# EAGLE schematic stm32_main_0_1 (EAGLE 5.10)
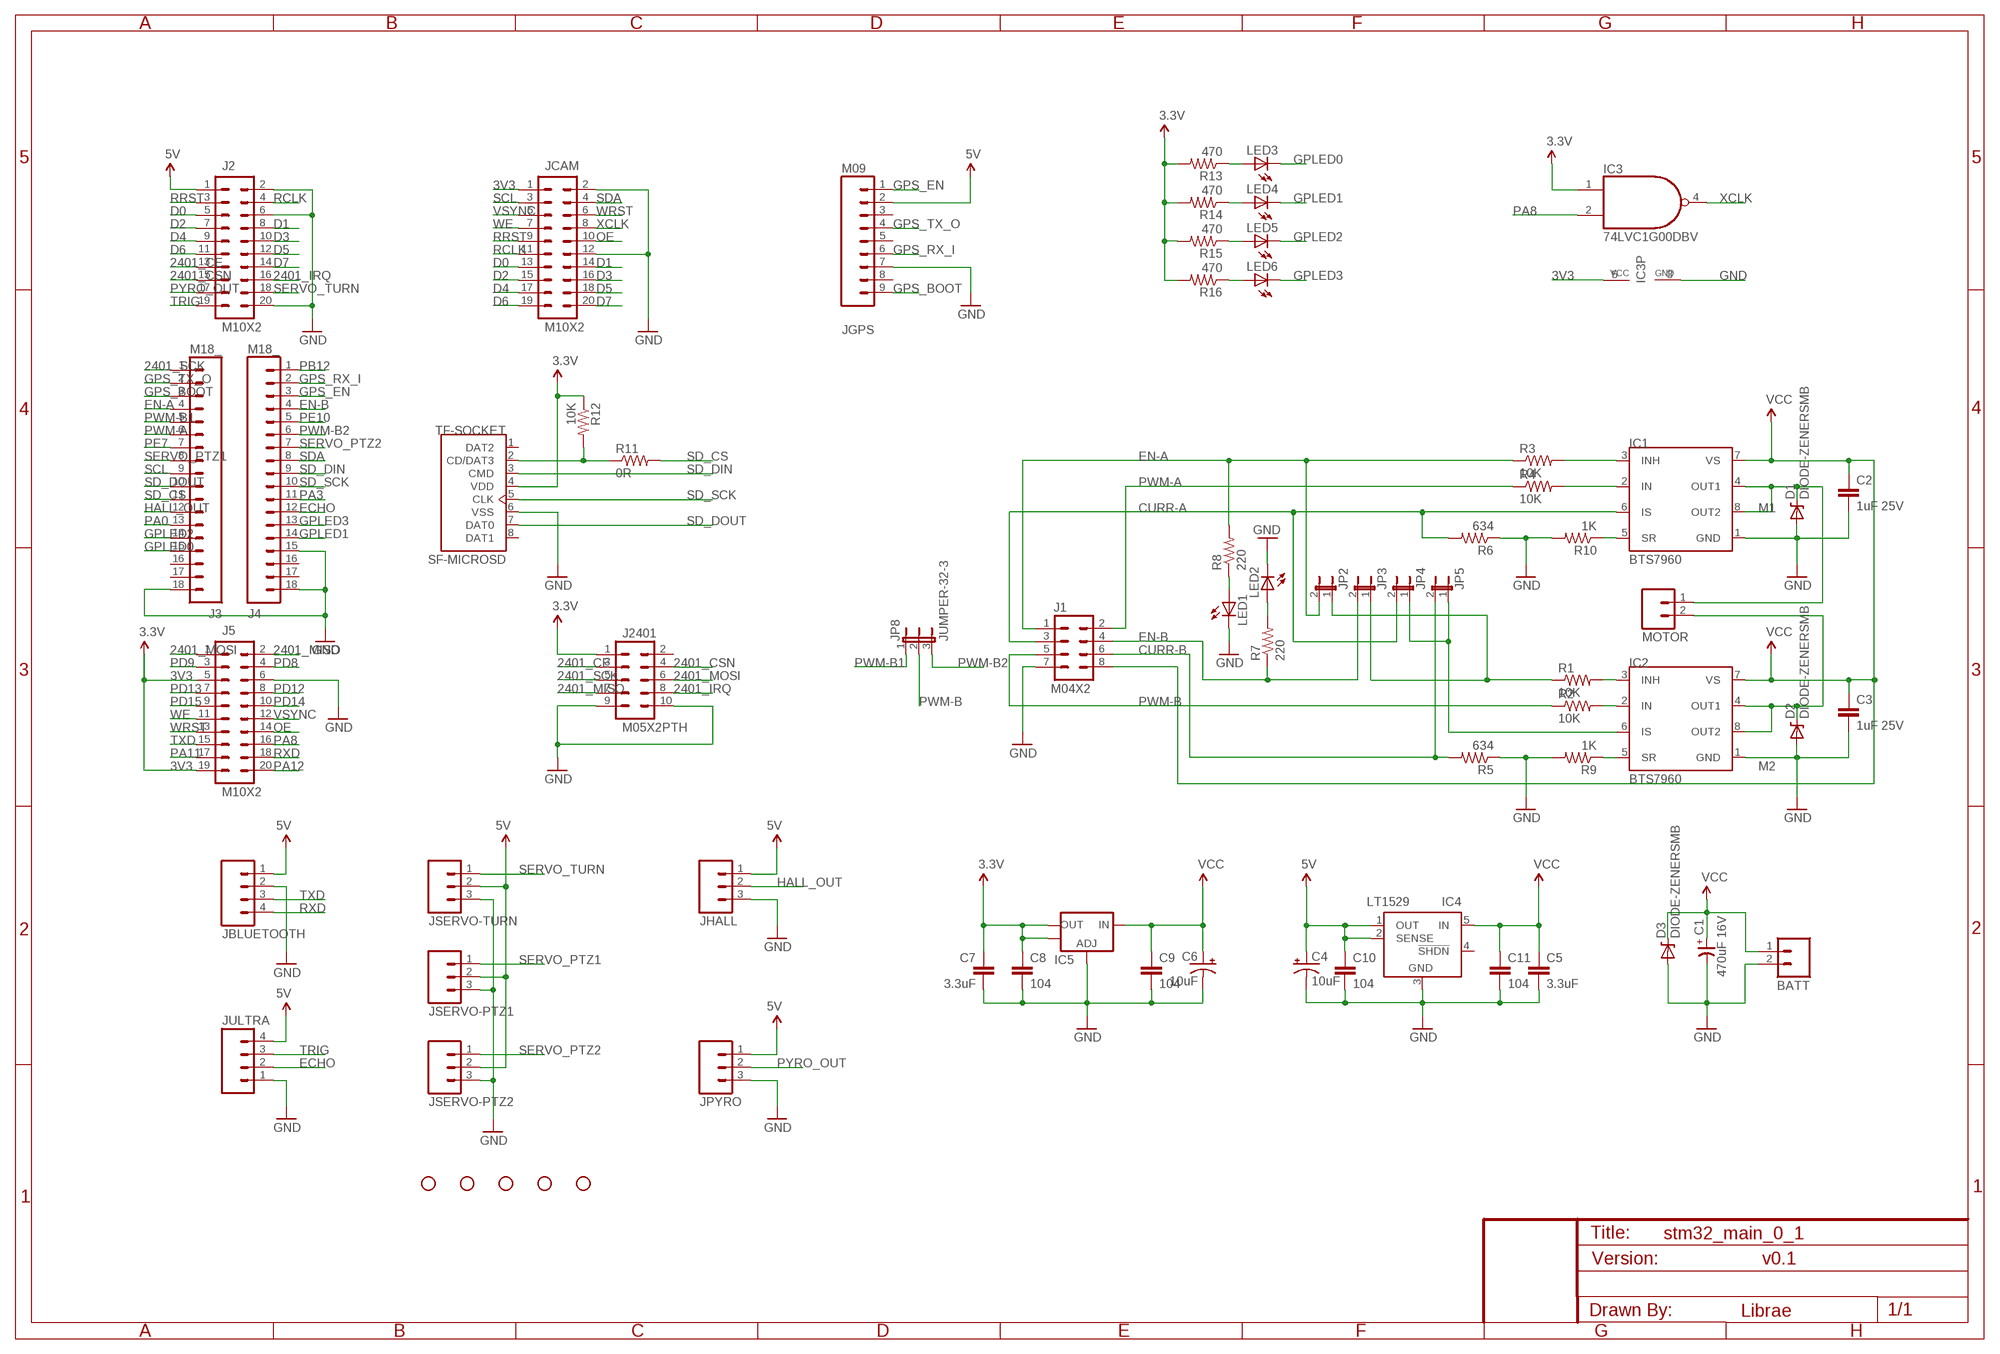
[diagram p0: schematic, sheet 1]

## Parts
BATT  M023.5MM  [SCREWTERMINAL-3.5MM-2]
C1  470uF 16V  CP-E-035X080  [E-035X080]
C2  1uF 25V  CAP0603-CAP  [0603-CAP]
C3  1uF 25V  CAP0603-CAP  [0603-CAP]
C4  10uF  CAP_POL3528  [EIA3528]
C5  3.3uF  CAP0603-CAP  [0603-CAP]
C6  10uF  CAP_POL3528  [EIA3528]
C7  3.3uF  CAP0603-CAP  [0603-CAP]
C8  104  CAP0603-CAP  [0603-CAP]
C9  104  CAP0603-CAP  [0603-CAP]
C10  104  CAP0603-CAP  [0603-CAP]
C11  104  CAP0603-CAP  [0603-CAP]
D1  DIODE-ZENERSMB  [SMB-DIODE]
D2  DIODE-ZENERSMB  [SMB-DIODE]
D3  DIODE-ZENERSMB  [SMB-DIODE]
IC1  BTS7960  [P-TO263-7-1]
IC2  BTS7960  [P-TO263-7-1]
IC3  74LVC1G00DBV  [SOT23-5]
IC4  LT1529  LT1129CT-5  [TO220-5]
IC5  V_REG_LM1117SOT223  [SOT223]
J1  M04X2  [2X4]
J2  M10X2  [2X10]
J3  M18_  [1X18]
J4  M18_  [1X18]
J5  M10X2  [2X10]
J2401  M05X2PTH  [AVR_ICSP]
JBLUETOOTH  M04PTH  [1X04]
JCAM  M10X2  [2X10]
JGPS  M09  [1X09]
JHALL  M03PTH  [1X03]
JP1  STAND-OFF  [STAND-OFF]
JP2  JUMPER-2SMD-NC  [SJ_2S]
JP3  JUMPER-2SMD-NC  [SJ_2S]
JP4  JUMPER-2SMD-NC  [SJ_2S]
JP5  JUMPER-2SMD-NC  [SJ_2S]
JP6  STAND-OFF  [STAND-OFF]
JP7  STAND-OFF  [STAND-OFF]
JP8  JUMPER-32-3  [SJ_3_PASTE2&3]
JP9  STAND-OFF  [STAND-OFF]
JP10  STAND-OFF  [STAND-OFF]
JPYRO  M03PTH  [1X03]
JSERVO-PTZ1  M03PTH  [1X03]
JSERVO-PTZ2  M03PTH  [1X03]
JSERVO-TURN  M03PTH  [1X03]
JULTRA  M04PTH  [1X04]
LED1  LED0603  [LED-0603]
LED2  LED0603  [LED-0603]
LED3  LED0603  [LED-0603]
LED4  LED0603  [LED-0603]
LED5  LED0603  [LED-0603]
LED6  LED0603  [LED-0603]
MOTOR  M023.5MM  [SCREWTERMINAL-3.5MM-2]
R1  10K  RESISTOR0603-RES  [0603-RES]
R2  10K  RESISTOR0603-RES  [0603-RES]
R3  10K  RESISTOR0603-RES  [0603-RES]
R4  10K  RESISTOR0603-RES  [0603-RES]
R5  634  RESISTOR0603-RES  [0603-RES]
R6  634  RESISTOR0603-RES  [0603-RES]
R7  220  RESISTOR0603-RES  [0603-RES]
R8  220  RESISTOR0603-RES  [0603-RES]
R9  1K  RESISTOR0603-RES  [0603-RES]
R10  1K  RESISTOR0603-RES  [0603-RES]
R11  0R  RESISTOR0603-RES  [0603-RES]
R12  10K  RESISTOR0603-RES  [0603-RES]
R13  470  RESISTOR0603-RES  [0603-RES]
R14  470  RESISTOR0603-RES  [0603-RES]
R15  470  RESISTOR0603-RES  [0603-RES]
R16  470  RESISTOR0603-RES  [0603-RES]
TF-SOCKET  SF-MICROSD  [MICROSD]

## Nets
3V3: C7.1 C8.1 IC3.1(I0) IC3.5(VCC) IC5.2(OUT) IC5.4(OUT) J5.5 J5.19 J2401.1 JCAM.1 R12.1 R13.2 R14.2 R15.2 R16.2 TF-SOCKET.4(VDD) ; supply symbol labelled 3.3V
5V: C4.A(+) C10.1 IC4.1(OUT) IC4.2(SENSE) J2.1 JBLUETOOTH.1 JGPS.2 JHALL.1 JPYRO.1 JSERVO-PTZ1.2 JSERVO-PTZ2.2 JSERVO-TURN.2 JULTRA.4
2401_CE: J2.13 J2401.3
2401_CSN: J2.15 J2401.4
2401_IRQ: J2.16 J2401.8
2401_MISO: J5.2 J2401.7
2401_MOSI: J5.1 J2401.6
2401_SCK: J3.1 J2401.5
CURR-A: IC1.6(IS) J1.3 JP4.2 R6.2
CURR-B: J1.6 JP5.2 R5.2
D0: J2.5 JCAM.13
D1: J2.8 JCAM.14
D2: J2.7 JCAM.15
D3: J2.10 JCAM.16
D4: J2.9 JCAM.17
D5: J2.12 JCAM.18
D6: J2.11 JCAM.19
D7: J2.14 JCAM.20
ECHO: J4.12 JULTRA.2
EN-A: J1.1 J3.4 JP2.2 R3.1 R8.2
EN-B: J1.4 J4.4 JP3.2 R7.1
GND: BATT.2 C1.- C2.2 C3.2 C4.C(-) C5.2 C6.C(-) C7.2 C8.2 C9.2 C10.2 C11.2 D1.A D2.A D3.A IC1.1(GND) IC2.1(GND) IC3.3(GND) IC4.3(GND) IC5.1(ADJ) J1.7 J2.2 J2.6 J2.20 J3.18 J4.15 J4.18 J5.6 J2401.9 J2401.10 JBLUETOOTH.2 JCAM.2 JCAM.12 JGPS.7 JHALL.3 JPYRO.3 JSERVO-PTZ1.3 JSERVO-PTZ2.3 JSERVO-TURN.3 JULTRA.1 LED1.C LED2.C R5.1 R6.1 R9.2 R10.2 TF-SOCKET.6(VSS)
GPLED0: J3.15 LED3.C
GPLED1: J4.14 LED4.C
GPLED2: J3.14 LED5.C
GPLED3: J4.13 LED6.C
GPS_BOOT: J3.3 JGPS.9
GPS_EN: J4.3 JGPS.1
GPS_RX_I: J4.2 JGPS.6
GPS_TX_O: J3.2 JGPS.4
HALL_OUT: J3.12 JHALL.2
M1: D1.C IC1.4(OUT1) IC1.8(OUT2) MOTOR.1
M2: D2.C IC2.4(OUT1) IC2.8(OUT2) MOTOR.2
N$1: IC2.3(INH) R1.2
N$2: JP2.1 JP3.1 R1.1
N$3: IC2.2(IN) R2.2
N$4: LED1.A R8.1
N$5: IC2.6(IS) JP4.1 JP5.1
N$6: LED2.A R7.2
N$7: IC1.3(INH) R3.2
N$8: IC1.2(IN) R4.2
N$9: IC1.5(SR) R10.1
N$10: IC2.5(SR) R9.1
N$11: R11.1 R12.2 TF-SOCKET.2(CD/DAT3)
N$15: LED5.A R15.1
N$16: LED4.A R14.1
N$17: LED3.A R13.1
N$18: LED6.A R16.1
OE: J5.14 JCAM.10
PA0: J3.13
PA3: J4.11
PA8: IC3.2(I1) J5.16
PA11: J5.17
PA12: J5.20
PB12: J4.1
PD8: J5.4
PD9: J5.3
PD12: J5.8
PD13: J5.7
PD14: J5.10
PD15: J5.9
PE7: J3.7
PE10: J4.5
PWM-A: J1.2 J3.6 R4.1
PWM-B: J1.5 JP8.2 R2.1
PWM-B1: J3.5 JP8.1
PWM-B2: J4.6 JP8.3
PYRO_OUT: J2.17 JPYRO.2
RCLK: J2.4 JCAM.11
RRST: J2.3 JCAM.9
RXD: J5.18 JBLUETOOTH.4
SCL: J3.9 JCAM.3
SD_CS: J3.11 R11.2
SD_DIN: J4.9 TF-SOCKET.3(CMD)
SD_DOUT: J3.10 TF-SOCKET.7(DAT0)
SD_SCK: J4.10 TF-SOCKET.5(CLK)
SDA: J4.8 JCAM.4
SERVO_PTZ1: J3.8 JSERVO-PTZ1.1
SERVO_PTZ2: J4.7 JSERVO-PTZ2.1
SERVO_TURN: J2.18 JSERVO-TURN.1
TRIG: J2.19 JULTRA.3
TXD: J5.15 JBLUETOOTH.3
VCC: BATT.1 C1.+ C2.1 C3.1 C5.1 C6.A(+) C9.1 C11.1 D3.C IC1.7(VS) IC2.7(VS) IC4.5(IN) IC5.3(IN) J1.8
VSYNC: J5.12 JCAM.5
WE: J5.11 JCAM.7
WRST: J5.13 JCAM.6
XCLK: IC3.4(O) JCAM.8
Unconnected: IC4.4(!SHDN) J3.16 J3.17 J4.16 J4.17 J2401.2 JGPS.3 JGPS.5 JGPS.8 TF-SOCKET.1(DAT2) TF-SOCKET.8(DAT1)

## Notes on the sheet
- v0.1

## Library data of the parts
BATT MOTOR = SparkFun:M02: Header 2 Standard 2-pin 0.1" header. Use with straight break away headers (SKU : PRT-00116), right angle break away headers (PRT-00553), swiss pins (PRT-00743), machine pins (PRT-00117), and female headers (PRT-00115). Molex polarized connector foot print use with SKU : PRT-08233 with associated crimp pins and housings.
C1 = cap-master:CP-: POLARIZED CAP
C2 C3 C5 C7-C11 = SparkFun:CAP: Capacitor Standard 0603 ceramic capacitor, and 0.1" leaded capacitor.
C4 C6 = SparkFun:CAP_POL: Capacitor Polarized These are standard SMD and PTH capacitors. Normally 10uF, 47uF, and 100uF in electrolytic and tantalum varieties. Always verify the external diameter of the through hole cap, it varies with capacity, voltage, and manufacturer. The EIA devices should be standard.
D1-D3 = SparkFun:DIODE-ZENER: Zener Diode Production Part - 8199 3.4V Zener Voltage
IC1 IC2 = infineon:BTS7960: High Current PN Half Bridge
IC3 = 74xx-little-us:74*1G00: 2-input NAND gate
IC4 = linear-technology:LT1129CT-5: VOLTAGE REGULATOR with shutdown
IC5 = SparkFun:V_REG_LM1117: Voltage Regulator LM1117 Standard adjustable voltage regulator but in SMD form. Spark Fun Electronics SKU : COM-00595
J1 = SparkFun:M04X2
J2 J5 JCAM = SparkFun:M10X2: This was SPECIALLY designed to be used with our Graphic LCD Backpack. Be sure you want to use this! It is not only staggered on each line of header holes, but IT IS ALSO offset of the center point of the top and bottom lines by 5 mil. This causes the headers to lock into place on the "standard" footprint on the LCD screen. The extra squares on the tdocu layer are there simply to reference other pins (if you were to actually populate a longer header than ten long - this is what we do with the backpacks).
J3 J4 = SparkFun:M18
J2401 = SparkFun:M05X2: Header 5x2 Standard 10-pin dual row 0.1" header. Commonly used with AVR-ISP. Use with Spark Fun Electronics SKU: PRT-00778
JBLUETOOTH JULTRA = SparkFun:M04: Header 4 Standard 4-pin 0.1" header. Use with straight break away headers (SKU : PRT-00116), right angle break away headers (PRT-00553), swiss pins (PRT-00743), machine pins (PRT-00117), and female headers (PRT-00115). Molex polarized connector foot print use with SKU : PRT-08231 with associated crimp pins and housings.
JGPS = SparkFun:M09: Header 9 Standard 9-pin 0.1" header. Use with straight break away headers (SKU : PRT-00116), right angle break away headers (PRT-00553), swiss pins (PRT-00743), machine pins (PRT-00117), and female headers (PRT-00115).
JHALL JPYRO JSERVO-PTZ1 JSERVO-PTZ2 JSERVO-TURN = SparkFun:M03: Header 3 Standard 3-pin 0.1" header. Use with straight break away headers (SKU : PRT-00116), right angle break away headers (PRT-00553), swiss pins (PRT-00743), machine pins (PRT-00117), and female headers (PRT-00115). Molex polarized connector foot print use with SKU : PRT-08232 with associated crimp pins and housings.
JP1 JP6 JP7 JP9 JP10 = SparkFun:STAND-OFF: Stand Off This is the mechanical footprint for a #4 phillips button head screw. Use the keepout ring to avoid running the screw head into surrounding components. SKU : PRT-00447
JP2-JP5 = SparkFun:JUMPER-2: Jumper Basic 0.1" spaced jumper. Use with breakaway headers.
JP8 = SparkFun:JUMPER-3
LED1-LED6 = SparkFun:LED: LEDs Standard schematic elements and footprints for 5mm, 3mm, 1206, and 0603 sized LEDs. 5mm - Spark Fun Electronics SKU : COM-00529 (and others)
R1-R16 = SparkFun:RESISTOR: Resistor Basic schematic elements and footprints for 0603, 1206, and PTH 1/10th watt (small) resistors.
TF-SOCKET = microsd:SF-MICROSD